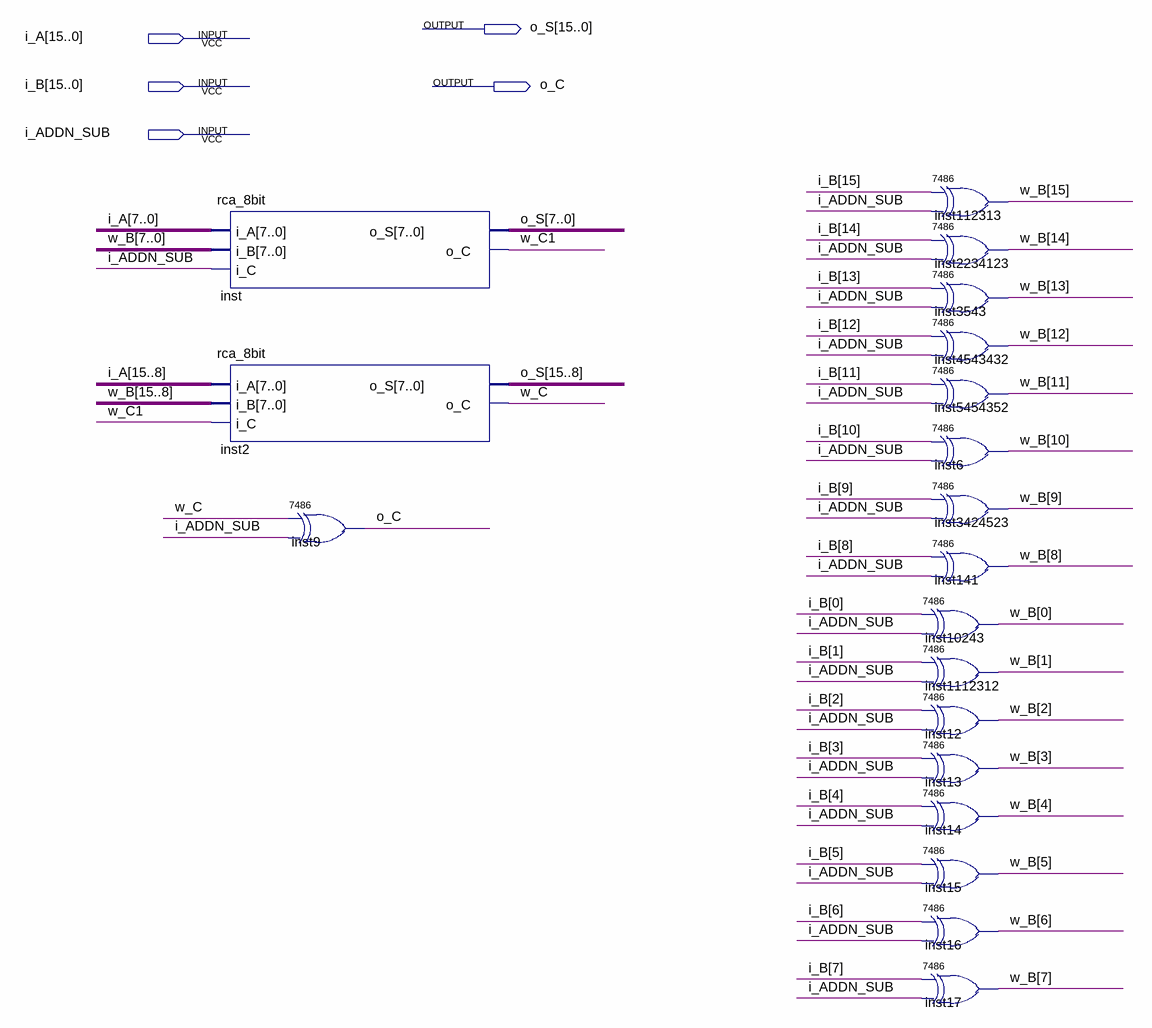
[diagram p0: schematic sheet]
// Quartus schematic addn_sub_16bit.bdf as structural Verilog: 19 symbols, 5 pins
module addn_sub_16bit (
  input  [15:0] i_A,
  input  [15:0] i_B,
  input  i_ADDN_SUB,
  output [15:0] o_S,
  output o_C
);

  wire w_C, w_C1;
  wire [15:0] w_B;

  rca_8bit inst (.i_A(i_A[7:0]), .i_B(w_B[7:0]), .i_C(i_ADDN_SUB), .o_S(o_S[7:0]), .o_C(w_C1));
  rca_8bit inst2 (.i_A(i_A[15:8]), .i_B(w_B[15:8]), .i_C(w_C1), .o_S(o_S[15:8]), .o_C(w_C));
  \7486  inst9 (.\2 (w_C), .\3 (i_ADDN_SUB), .\1 (o_C));
  \7486  inst112313 (.\2 (i_B[15]), .\3 (i_ADDN_SUB), .\1 (w_B[15]));
  \7486  inst2234123 (.\2 (i_B[14]), .\3 (i_ADDN_SUB), .\1 (w_B[14]));
  \7486  inst3543 (.\2 (i_B[13]), .\3 (i_ADDN_SUB), .\1 (w_B[13]));
  \7486  inst4543432 (.\2 (i_B[12]), .\3 (i_ADDN_SUB), .\1 (w_B[12]));
  \7486  inst5454352 (.\2 (i_B[11]), .\3 (i_ADDN_SUB), .\1 (w_B[11]));
  \7486  inst6 (.\2 (i_B[10]), .\3 (i_ADDN_SUB), .\1 (w_B[10]));
  \7486  inst3424523 (.\2 (i_B[9]), .\3 (i_ADDN_SUB), .\1 (w_B[9]));
  \7486  inst141 (.\2 (i_B[8]), .\3 (i_ADDN_SUB), .\1 (w_B[8]));
  \7486  inst10243 (.\2 (i_B[0]), .\3 (i_ADDN_SUB), .\1 (w_B[0]));
  \7486  inst1112312 (.\2 (i_B[1]), .\3 (i_ADDN_SUB), .\1 (w_B[1]));
  \7486  inst12 (.\2 (i_B[2]), .\3 (i_ADDN_SUB), .\1 (w_B[2]));
  \7486  inst13 (.\2 (i_B[3]), .\3 (i_ADDN_SUB), .\1 (w_B[3]));
  \7486  inst14 (.\2 (i_B[4]), .\3 (i_ADDN_SUB), .\1 (w_B[4]));
  \7486  inst15 (.\2 (i_B[5]), .\3 (i_ADDN_SUB), .\1 (w_B[5]));
  \7486  inst16 (.\2 (i_B[6]), .\3 (i_ADDN_SUB), .\1 (w_B[6]));
  \7486  inst17 (.\2 (i_B[7]), .\3 (i_ADDN_SUB), .\1 (w_B[7]));
endmodule
